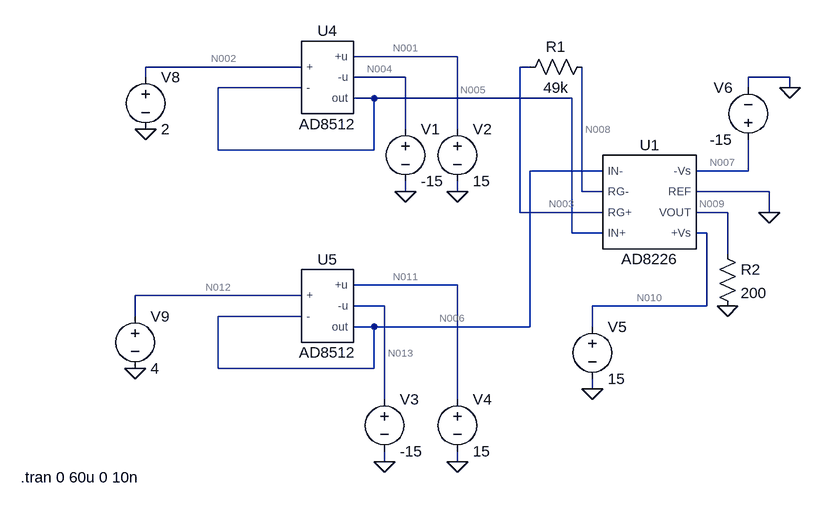
[diagram p0: schematic tolko usiliteli.asc]
tolko usiliteli.asc, the LTspice schematic file:
Version 4.1
SHEET 1 1384 824
WIRE 608 160 448 160
WIRE 368 176 128 176
WIRE 720 176 704 176
WIRE 128 192 128 176
WIRE 528 192 448 192
WIRE 1120 192 1056 192
WIRE 368 208 240 208
WIRE 1056 208 1056 192
WIRE 1120 208 1120 192
WIRE 480 224 448 224
WIRE 784 224 480 224
WIRE 528 272 528 192
WIRE 608 272 608 160
WIRE 240 304 240 208
WIRE 480 304 480 224
WIRE 480 304 240 304
WIRE 832 336 720 336
WIRE 1056 336 1056 288
WIRE 1056 336 976 336
WIRE 528 368 528 352
WIRE 608 368 608 352
WIRE 800 368 800 176
WIRE 832 368 800 368
WIRE 1088 368 976 368
WIRE 704 400 704 176
WIRE 832 400 704 400
WIRE 1024 400 976 400
WIRE 1088 400 1088 368
WIRE 784 432 784 224
WIRE 832 432 784 432
WIRE 992 432 976 432
WIRE 1024 464 1024 400
WIRE 608 512 448 512
WIRE 368 528 112 528
WIRE 496 544 448 544
WIRE 992 544 992 432
WIRE 992 544 816 544
WIRE 112 560 112 528
WIRE 368 560 240 560
WIRE 480 576 448 576
WIRE 720 576 720 336
WIRE 720 576 480 576
WIRE 816 576 816 544
WIRE 240 640 240 560
WIRE 480 640 480 576
WIRE 480 640 240 640
WIRE 816 672 816 656
WIRE 496 688 496 544
WIRE 608 688 608 512
WIRE 496 784 496 768
WIRE 608 784 608 768
FLAG 528 368 0
FLAG 608 368 0
FLAG 608 784 0
FLAG 496 784 0
FLAG 816 672 0
FLAG 1120 208 0
FLAG 128 272 0
FLAG 112 640 0
FLAG 1088 400 0
FLAG 1024 544 0
SYMBOL voltage 528 256 R0
WINDOW 123 0 0 Left 0
WINDOW 39 0 0 Left 0
SYMATTR InstName V1
SYMATTR Value -15
SYMBOL voltage 608 256 R0
WINDOW 123 0 0 Left 0
WINDOW 39 0 0 Left 0
SYMATTR InstName V2
SYMATTR Value 15
SYMBOL voltage 496 672 R0
WINDOW 123 0 0 Left 0
WINDOW 39 0 0 Left 0
SYMATTR InstName V3
SYMATTR Value -15
SYMBOL voltage 608 672 R0
WINDOW 123 0 0 Left 0
WINDOW 39 0 0 Left 0
SYMATTR InstName V4
SYMATTR Value 15
SYMBOL voltage 816 560 R0
WINDOW 123 0 0 Left 0
WINDOW 39 0 0 Left 0
SYMATTR InstName V5
SYMATTR Value 15
SYMBOL voltage 1056 304 R180
WINDOW 0 24 96 Left 2
WINDOW 3 24 16 Left 2
WINDOW 123 0 0 Left 0
WINDOW 39 0 0 Left 0
SYMATTR InstName V6
SYMATTR Value -15
SYMBOL voltage 128 176 R0
WINDOW 123 0 0 Left 0
WINDOW 39 0 0 Left 0
SYMATTR InstName V8
SYMATTR Value 2
SYMBOL voltage 112 544 R0
WINDOW 123 0 0 Left 0
WINDOW 39 0 0 Left 0
SYMATTR InstName V9
SYMATTR Value 4
SYMBOL res 816 160 R90
WINDOW 0 0 56 VBottom 2
WINDOW 3 32 56 VTop 2
SYMATTR InstName R1
SYMATTR Value 49k
SYMBOL res 1008 448 R0
SYMATTR InstName R2
SYMATTR Value 200
SYMBOL AD8512 400 192 R0
SYMATTR InstName U4
SYMBOL AD8512 400 544 R0
SYMATTR InstName U5
SYMBOL AD8226 896 384 R0
SYMATTR InstName U1
TEXT -64 808 Left 2 !.tran 0 60u 0 10n

The netlist it stands for:
* tolko usiliteli.asc
V1 N004 0 -15
V2 N001 0 15
V3 N013 0 -15
V4 N011 0 15
V5 N010 0 15
V6 N007 0 -15
V8 N002 0 2
V9 N012 0 4
R1 N008 N003 49k
R2 N009 0 200
X§U4 N002 N005 N001 N004 N005 AD8512  ; pins + - +u -u out
X§U5 N012 N006 N011 N013 N006 AD8512  ; pins + - +u -u out
X§U1 N006 N008 N003 N005 N007 0 N009 N010 AD8226  ; pins IN- RG- RG+ IN+ -Vs REF VOUT +Vs
.tran 0 60u 0 10n
.lib C:\Users\User\Downloads\ad8512.cir
.lib \\ARX-704\Line-2-ARX\Áëîê áàçû - Ïîäëîæêè\Dradt15mk1\ad8226.cir
.backanno
.end

* Results of the author's LTspice run, read from the files saved beside the schematic
* Operating Point, zero values left out:
*   V(n005) = 2 V
*   V(n004) = -15 V
*   V(n012) = 4 V
*   V(n011) = 15 V
*   V(n007) = -15 V
*   V(n003) = 2.614 V
*   V(n009) = -3.977 V
*   V(n002) = 2 V
*   V(n001) = 15 V
*   V(n006) = 4 V
*   V(n013) = -15 V
*   V(n010) = 15 V
*   V(n008) = 4.614 V
*   I(V1) = 2.226 mA
*   I(V5) = -330 µA
*   I(V2) = -2.226 mA
*   I(V3) = 2.227 mA
*   I(V9) = -157 pA
*   I(R1) = 40.82 µA
*   I(R2) = -19.89 mA
*   I(V4) = -2.227 mA
*   I(V6) = 334 µA
*   I(V8) = -157 pA